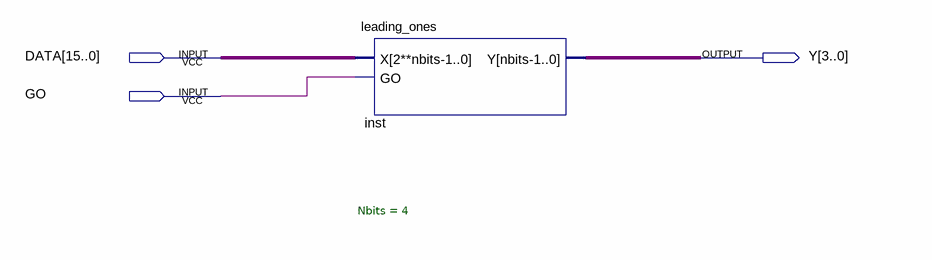
[diagram p0: schematic sheet]
// Quartus schematic behavioural.bdf as structural Verilog: 1 symbols, 3 pins
module behavioural (
  input  [15:0] DATA,
  input  GO,
  output [3:0] Y
);

  leading_ones #(.Nbits(4)) inst (.X(DATA), .GO(GO), .Y(Y));
endmodule
